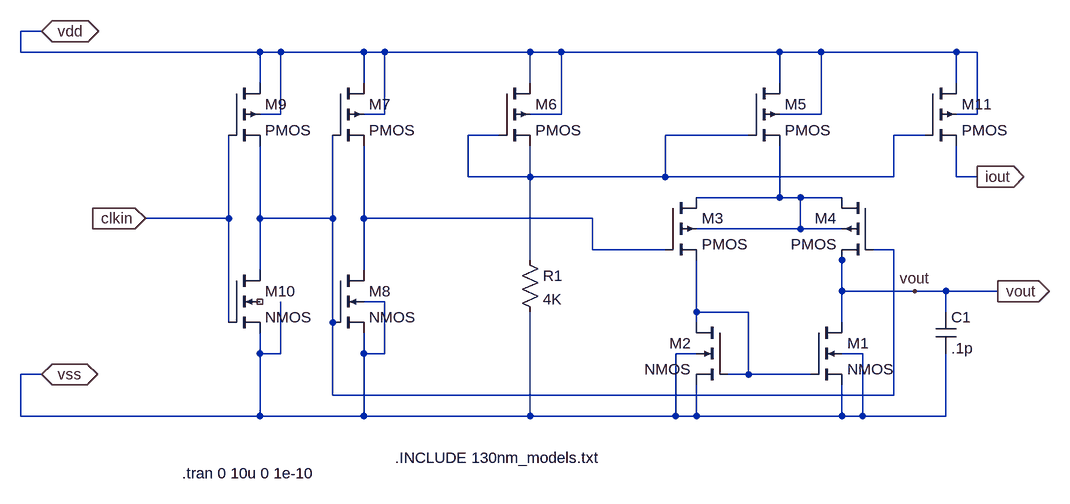
[diagram p0: schematic CurrentSteeringRampGnerator3sym.asc]
CurrentSteeringRampGnerator3sym.asc, the LTspice schematic file:
Version 4
SHEET 1 880 680
WIRE -944 -224 -976 -224
WIRE -976 -192 -976 -224
WIRE -608 -192 -976 -192
WIRE -576 -192 -608 -192
WIRE -448 -192 -576 -192
WIRE -416 -192 -448 -192
WIRE -192 -192 -416 -192
WIRE -144 -192 -192 -192
WIRE 192 -192 -144 -192
WIRE 256 -192 192 -192
WIRE 464 -192 256 -192
WIRE 496 -192 464 -192
WIRE -608 -144 -608 -192
WIRE -448 -144 -448 -192
WIRE -192 -144 -192 -192
WIRE 192 -144 192 -192
WIRE 464 -144 464 -192
WIRE -576 -96 -576 -192
WIRE -576 -96 -608 -96
WIRE -416 -96 -416 -192
WIRE -416 -96 -448 -96
WIRE -144 -96 -144 -192
WIRE -144 -96 -192 -96
WIRE 256 -96 256 -192
WIRE 256 -96 192 -96
WIRE 496 -96 496 -192
WIRE 496 -96 464 -96
WIRE -240 -64 -288 -64
WIRE 144 -64 16 -64
WIRE 416 -64 368 -64
WIRE -288 0 -288 -64
WIRE -192 0 -192 -48
WIRE -192 0 -288 0
WIRE 16 0 16 -64
WIRE 16 0 -192 0
WIRE 368 0 368 -64
WIRE 368 0 16 0
WIRE 464 0 464 -48
WIRE 496 0 464 0
WIRE 192 32 192 -48
WIRE 192 32 64 32
WIRE 224 32 192 32
WIRE 288 32 224 32
WIRE -656 64 -656 -64
WIRE -656 64 -784 64
WIRE -608 64 -608 -48
WIRE -496 64 -496 -64
WIRE -496 64 -608 64
WIRE -448 64 -448 -48
WIRE -96 64 -448 64
WIRE 224 80 224 32
WIRE 224 80 64 80
WIRE 288 80 224 80
WIRE -96 112 -96 64
WIRE 16 112 -96 112
WIRE 368 112 336 112
WIRE -192 128 -192 0
WIRE 288 128 288 112
WIRE -608 144 -608 64
WIRE -448 144 -448 64
WIRE 288 176 288 128
WIRE 400 176 288 176
WIRE 448 176 400 176
WIRE 528 176 448 176
WIRE -416 192 -448 192
WIRE 64 208 64 128
WIRE 144 208 64 208
WIRE 448 208 448 176
WIRE -656 224 -656 64
WIRE -496 224 -496 64
WIRE 64 224 64 208
WIRE 288 224 288 176
WIRE -608 272 -608 240
WIRE -576 272 -576 192
WIRE -576 272 -608 272
WIRE -448 272 -448 240
WIRE -416 272 -416 192
WIRE -416 272 -448 272
WIRE 64 272 32 272
WIRE 320 272 288 272
WIRE -944 304 -976 304
WIRE 144 304 144 208
WIRE 144 304 112 304
WIRE 240 304 144 304
WIRE -496 336 -496 224
WIRE 368 336 368 112
WIRE 368 336 -496 336
WIRE -976 368 -976 304
WIRE -608 368 -608 272
WIRE -608 368 -976 368
WIRE -448 368 -448 272
WIRE -448 368 -608 368
WIRE -192 368 -192 208
WIRE -192 368 -448 368
WIRE 32 368 32 272
WIRE 32 368 -192 368
WIRE 64 368 64 320
WIRE 64 368 32 368
WIRE 288 368 288 320
WIRE 288 368 64 368
WIRE 320 368 320 272
WIRE 320 368 288 368
WIRE 448 368 448 272
WIRE 448 368 320 368
FLAG 400 176 vout
FLAG 528 176 vout
IOPIN 528 176 Out
FLAG -944 -224 vdd
IOPIN -944 -224 BiDir
FLAG -944 304 vss
IOPIN -944 304 BiDir
FLAG -784 64 clkin
IOPIN -784 64 In
FLAG 496 0 iout
IOPIN 496 0 Out
SYMBOL nmos4 240 224 R0
SYMATTR InstName M1
SYMATTR Value2 l=1u w=20u
SYMBOL nmos4 112 224 M0
SYMATTR InstName M2
SYMATTR Value2 l=1u w=20u
SYMBOL pmos4 16 32 R0
SYMATTR InstName M3
SYMATTR Value2 l=1u w=20u
SYMBOL pmos4 336 32 M0
SYMATTR InstName M4
SYMATTR Value2 l=1u w=20u
SYMBOL pmos4 144 -144 R0
SYMATTR InstName M5
SYMATTR Value2 l=1u w=20u
SYMBOL pmos4 -240 -144 R0
SYMATTR InstName M6
SYMATTR Value2 l=1u w=10u
SYMBOL res -208 112 R0
SYMATTR InstName R1
SYMATTR Value 4K
SYMBOL pmos4 -496 -144 R0
SYMATTR InstName M7
SYMBOL nmos4 -496 144 R0
SYMATTR InstName M8
SYMBOL pmos4 -656 -144 R0
SYMATTR InstName M9
SYMATTR Value2 l=.2u w=2u
SYMBOL nmos4 -656 144 R0
SYMATTR InstName M10
SYMATTR Value2 l=.2u w=1u
SYMBOL cap 432 208 R0
SYMATTR InstName C1
SYMATTR Value .1p
SYMBOL pmos4 416 -144 R0
SYMATTR InstName M11
SYMATTR Value2 l=1u w=2u
TEXT -728 456 Left 2 !.tran 0 10u 0 1e-10
TEXT -400 432 Left 2 !.INCLUDE 130nm_models.txt

The netlist it stands for:
* CurrentSteeringRampGnerator3sym.asc
M1 vout N005 vss vss NMOS l=1u w=20u
M2 N005 N005 vss vss NMOS l=1u w=20u
M3 N002 N004 N005 N002 PMOS l=1u w=20u
M4 N002 N003 vout N002 PMOS l=1u w=20u
M5 vdd N001 N002 vdd PMOS l=1u w=20u
M6 vdd N001 N001 vdd PMOS l=1u w=10u
R1 N001 vss 4K
M7 vdd N003 N004 vdd PMOS
M8 N004 N003 vss vss NMOS
M9 vdd clkin N003 vdd PMOS l=.2u w=2u
M10 N003 clkin vss NC_01 NMOS l=.2u w=1u
C1 vout vss .1p
M11 vdd N001 iout vdd PMOS l=1u w=2u
.model NMOS NMOS
.model PMOS PMOS
.lib standard.mos
.tran 0 10u 0 1e-10
.INCLUDE 130nm_models.txt
.backanno
.end